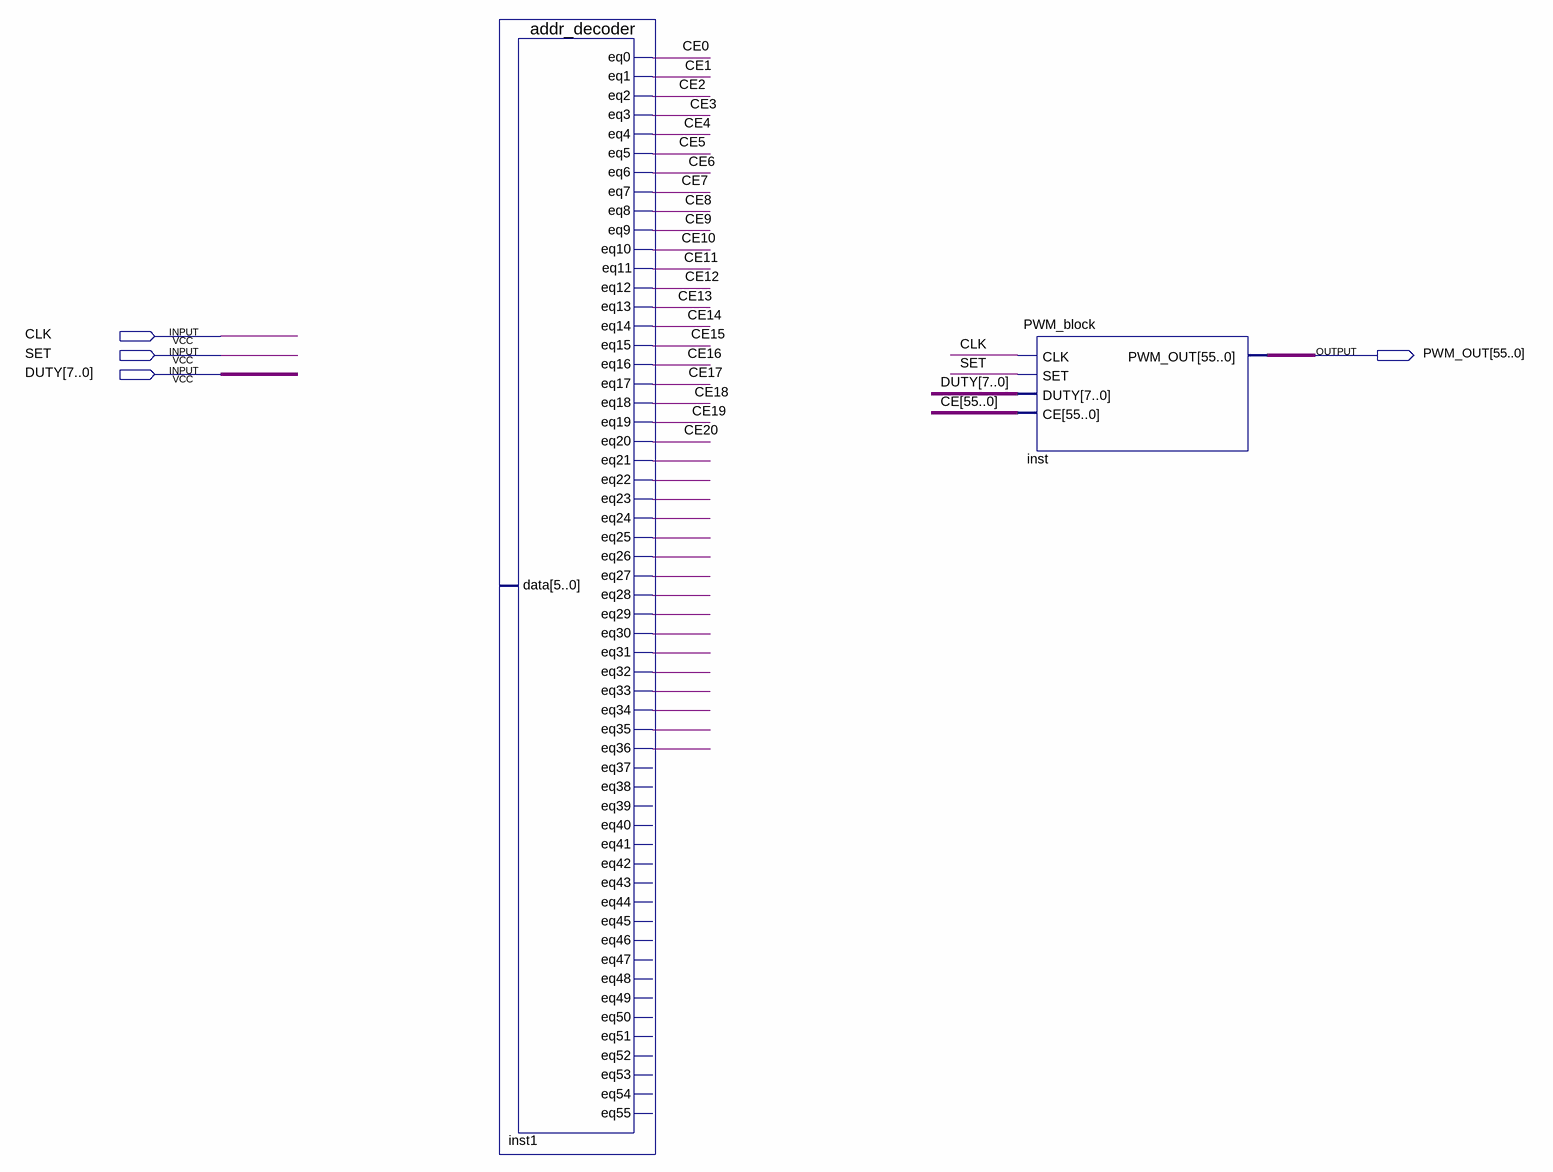
[diagram p0: schematic sheet]
// Quartus schematic choin.bdf as structural Verilog: 2 symbols, 4 pins
module choin (
  input  CLK,
  input  SET,
  input  [7:0] DUTY,
  output [55:0] PWM_OUT
);

  wire inst1_eq21, inst1_eq22, inst1_eq23, inst1_eq24, inst1_eq25, inst1_eq26, inst1_eq27, inst1_eq28,
       inst1_eq29, inst1_eq30, inst1_eq31, inst1_eq32, inst1_eq33, inst1_eq34, inst1_eq35, inst1_eq36;
  wire [55:0] CE;

  addr_decoder inst1 (
    .eq0(CE[0]), .eq1(CE[1]), .eq2(CE[2]), .eq3(CE[3]), .eq4(CE[4]), .eq5(CE[5]), .eq6(CE[6]), .eq7(CE[7]),
    .eq8(CE[8]), .eq9(CE[9]), .eq10(CE[10]), .eq11(CE[11]), .eq12(CE[12]), .eq13(CE[13]), .eq14(CE[14]),
    .eq15(CE[15]), .eq16(CE[16]), .eq17(CE[17]), .eq18(CE[18]), .eq19(CE[19]), .eq20(CE[20]),
    .eq21(inst1_eq21), .eq22(inst1_eq22), .eq23(inst1_eq23), .eq24(inst1_eq24), .eq25(inst1_eq25),
    .eq26(inst1_eq26), .eq27(inst1_eq27), .eq28(inst1_eq28), .eq29(inst1_eq29), .eq30(inst1_eq30),
    .eq31(inst1_eq31), .eq32(inst1_eq32), .eq33(inst1_eq33), .eq34(inst1_eq34), .eq35(inst1_eq35),
    .eq36(inst1_eq36));  // open: data, eq37, eq38, eq39, eq40, eq41, eq42, eq43, eq44, eq45, eq46, eq47, eq48, eq49, eq50, eq51, eq52, eq53, eq54, eq55
  PWM_block inst (.CLK(CLK), .SET(SET), .DUTY(DUTY), .CE(CE), .PWM_OUT(PWM_OUT));
endmodule
